# Altium project FLEXI_HAL_Quark.PrjPCB (part 4 of 5)

## Sheet Limit_Switches.SchDoc: RP2040 CNC
size B; Author: AM; CompanyName: Expatria Technologies; DrawnBy: A.Marles; Engineer: AM; Organization: Expatria Technolgoies; DocumentNumber: 7; Revision: A1; SheetNumber: 7; SheetTotal: 14
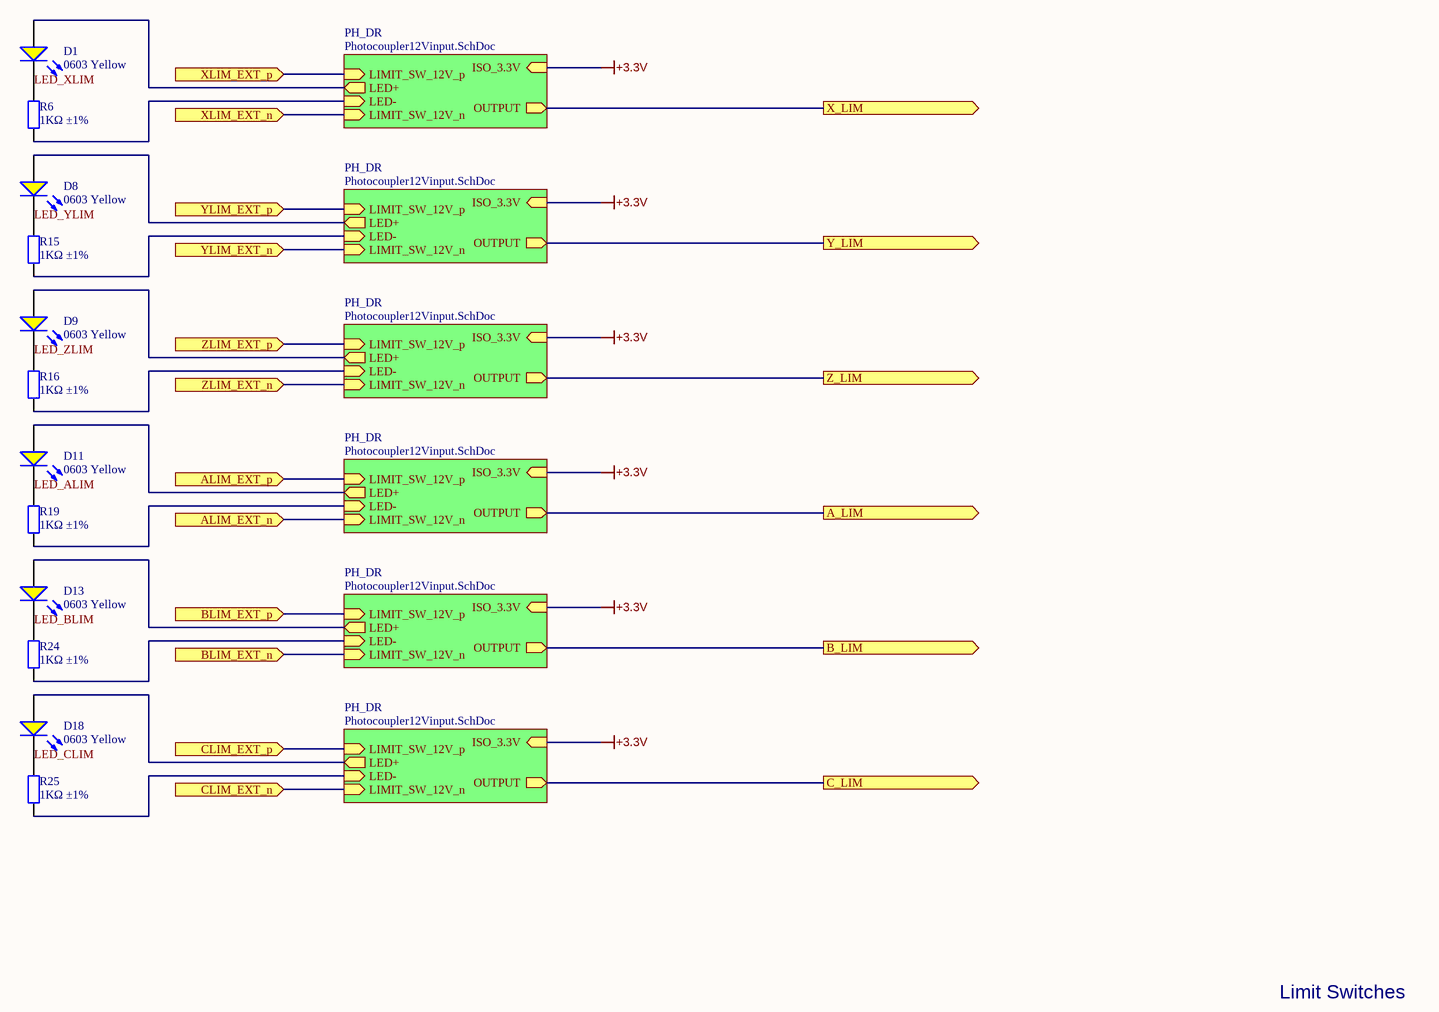
[diagram p18: Limit_Switches.SchDoc]

### Parts
D1  0603 Yellow  [0603_LED_S1]
D8  0603 Yellow  [0603_LED_S1]
D9  0603 Yellow  [0603_LED_S1]
D11  0603 Yellow  [0603_LED_S1]
D13  0603 Yellow  [0603_LED_S1]
D18  0603 Yellow  [0603_LED_S1]
R6  1KΩ ±1%  [0603_R]
R15  1KΩ ±1%  [0603_R]
R16  1KΩ ±1%  [0603_R]
R19  1KΩ ±1%  [0603_R]
R24  1KΩ ±1%  [0603_R]
R25  1KΩ ±1%  [0603_R]

### Sub-sheets
PH_DR = Photocoupler12Vinput.SchDoc: OUTPUT (out), LED+ (out), LED- (in), ISO_3.3V (in), LIMIT_SW_12V_n (in), LIMIT_SW_12V_p (in)
PH_DR = Photocoupler12Vinput.SchDoc: OUTPUT (out), LED+ (out), LED- (in), ISO_3.3V (in), LIMIT_SW_12V_n (in), LIMIT_SW_12V_p (in)
PH_DR = Photocoupler12Vinput.SchDoc: OUTPUT (out), LED+ (out), LED- (in), ISO_3.3V (in), LIMIT_SW_12V_n (in), LIMIT_SW_12V_p (in)
PH_DR = Photocoupler12Vinput.SchDoc: OUTPUT (out), LED+ (out), LED- (in), ISO_3.3V (in), LIMIT_SW_12V_n (in), LIMIT_SW_12V_p (in)
PH_DR = Photocoupler12Vinput.SchDoc: OUTPUT (out), LED+ (out), LED- (in), ISO_3.3V (in), LIMIT_SW_12V_n (in), LIMIT_SW_12V_p (in)
PH_DR = Photocoupler12Vinput.SchDoc: OUTPUT (out), LED+ (out), LED- (in), ISO_3.3V (in), LIMIT_SW_12V_n (in), LIMIT_SW_12V_p (in)

### Ports
A_LIM (out), ALIM_EXT_n (in), ALIM_EXT_p (in), B_LIM (out), BLIM_EXT_n (in), BLIM_EXT_p (in), C_LIM (out), CLIM_EXT_n (in), CLIM_EXT_p (in), X_LIM (out), XLIM_EXT_n (in), XLIM_EXT_p (in), Y_LIM (out), YLIM_EXT_n (in), YLIM_EXT_p (in), Z_LIM (out), ZLIM_EXT_n (in), ZLIM_EXT_p (in)

### Nets
+3.3V: D1.A D8.A D9.A D11.A D13.A D18.A ; sheet PH_DR/LED+, sheet PH_DR/ISO_3.3V, sheet PH_DR/LED+, sheet PH_DR/ISO_3.3V, sheet PH_DR/LED+, sheet PH_DR/ISO_3.3V, sheet PH_DR/LED+, sheet PH_DR/ISO_3.3V, sheet PH_DR/LED+, sheet PH_DR/ISO_3.3V, sheet PH_DR/LED+, sheet PH_DR/ISO_3.3V
A_LIM: R19.2 ; port A_LIM, sheet PH_DR/OUTPUT, sheet PH_DR/LED-
ALIM_EXT_n: port ALIM_EXT_n, sheet PH_DR/LIMIT_SW_12V_n
ALIM_EXT_p: port ALIM_EXT_p, sheet PH_DR/LIMIT_SW_12V_p
B_LIM: R24.2 ; port B_LIM, sheet PH_DR/OUTPUT, sheet PH_DR/LED-
BLIM_EXT_n: port BLIM_EXT_n, sheet PH_DR/LIMIT_SW_12V_n
BLIM_EXT_p: port BLIM_EXT_p, sheet PH_DR/LIMIT_SW_12V_p
C_LIM: R25.2 ; port C_LIM, sheet PH_DR/OUTPUT, sheet PH_DR/LED-
CLIM_EXT_n: port CLIM_EXT_n, sheet PH_DR/LIMIT_SW_12V_n
CLIM_EXT_p: port CLIM_EXT_p, sheet PH_DR/LIMIT_SW_12V_p
LED_ALIM: D11.K R19.1
LED_BLIM: D13.K R24.1
LED_CLIM: D18.K R25.1
LED_XLIM: D1.K R6.1
LED_YLIM: D8.K R15.1
LED_ZLIM: D9.K R16.1
X_LIM: R6.2 ; port X_LIM, sheet PH_DR/OUTPUT, sheet PH_DR/LED-
XLIM_EXT_n: port XLIM_EXT_n, sheet PH_DR/LIMIT_SW_12V_n
XLIM_EXT_p: port XLIM_EXT_p, sheet PH_DR/LIMIT_SW_12V_p
Y_LIM: R15.2 ; port Y_LIM, sheet PH_DR/OUTPUT, sheet PH_DR/LED-
YLIM_EXT_n: port YLIM_EXT_n, sheet PH_DR/LIMIT_SW_12V_n
YLIM_EXT_p: port YLIM_EXT_p, sheet PH_DR/LIMIT_SW_12V_p
Z_LIM: R16.2 ; port Z_LIM, sheet PH_DR/OUTPUT, sheet PH_DR/LED-
ZLIM_EXT_n: port ZLIM_EXT_n, sheet PH_DR/LIMIT_SW_12V_n
ZLIM_EXT_p: port ZLIM_EXT_p, sheet PH_DR/LIMIT_SW_12V_p

### Notes on the sheet
- Limit Switches
- SHEET
- Expatria Technologies
- 1136 Glade Court
- Port Coquitlam, BC V3B 1R5
- PROJECT
- SIZE
- ENGR
- MODIFIED
- DOCUMENT
- REV
- Copyright Expatria Technologies 2022. This document describes Open Hardware and is licensed under the CERN-OHL-S v2. No warranty is implied or expressed.
- EMAIL: INFO@EXPATRIA.CA
- B
- /

### Library data of the parts
D1 D8 D9 D11 D13 D18 = 0603 LED Yellow: LED; ComponentLink1Description: 供应商链接; ComponentLink1URL: http://www.szlcsc.com/product/details_73147.html; Package: 0603; Supplier: LC; SuppliersPartNumber: C72038; Color: Yellow
R6 R15 R16 R19 R24 R25 = 0603 1K (1001) 1%: Chip resistor; Manufacturer: Uniroyal Elec; PartNumber: 0603WAF1001T5E; Power: 1/10W; ComponentLink1Description: Supplier link; ComponentLink1URL: http://www.szlcsc.com/product/details_21904.html; Package: 0603; Supplier: LC; SuppliersPartNumber: C21190; Resistance: 1KΩ; Tolerance: 1%

## Sheet Photocoupler12Vinput.SchDoc: STM32F446 CNC
size B; Author: AM; CompanyName: Expatria Technologies; DrawnBy: A.Marles; Engineer: AM; Organization: Expatria Technolgoies; DocumentNumber: 14; Revision: A1; SheetNumber: 14; SheetTotal: 14
Used 11 times, as channels STM32F446 CNC Controller/Mezzanine Connector/LIM_SW/PH_DR, STM32F446 CNC Controller/Mezzanine Connector/LIM_SW/PH_DR, STM32F446 CNC Controller/Mezzanine Connector/LIM_SW/PH_DR, STM32F446 CNC Controller/Mezzanine Connector/LIM_SW/PH_DR, STM32F446 CNC Controller/Mezzanine Connector/LIM_SW/PH_DR, STM32F446 CNC Controller/Mezzanine Connector/LIM_SW/PH_DR, STM32F446 CNC Controller/Mezzanine Connector/USR_SW/PH_CY, STM32F446 CNC Controller/Mezzanine Connector/USR_SW/PH_FD, STM32F446 CNC Controller/Mezzanine Connector/USR_SW/PH_DR, STM32F446 CNC Controller/Mezzanine Connector/USR_SW/PH_TL, STM32F446 CNC Controller/Mezzanine Connector/USR_SW/PH_PR. Parts and nets are listed once, with the designators drawn on the sheet.
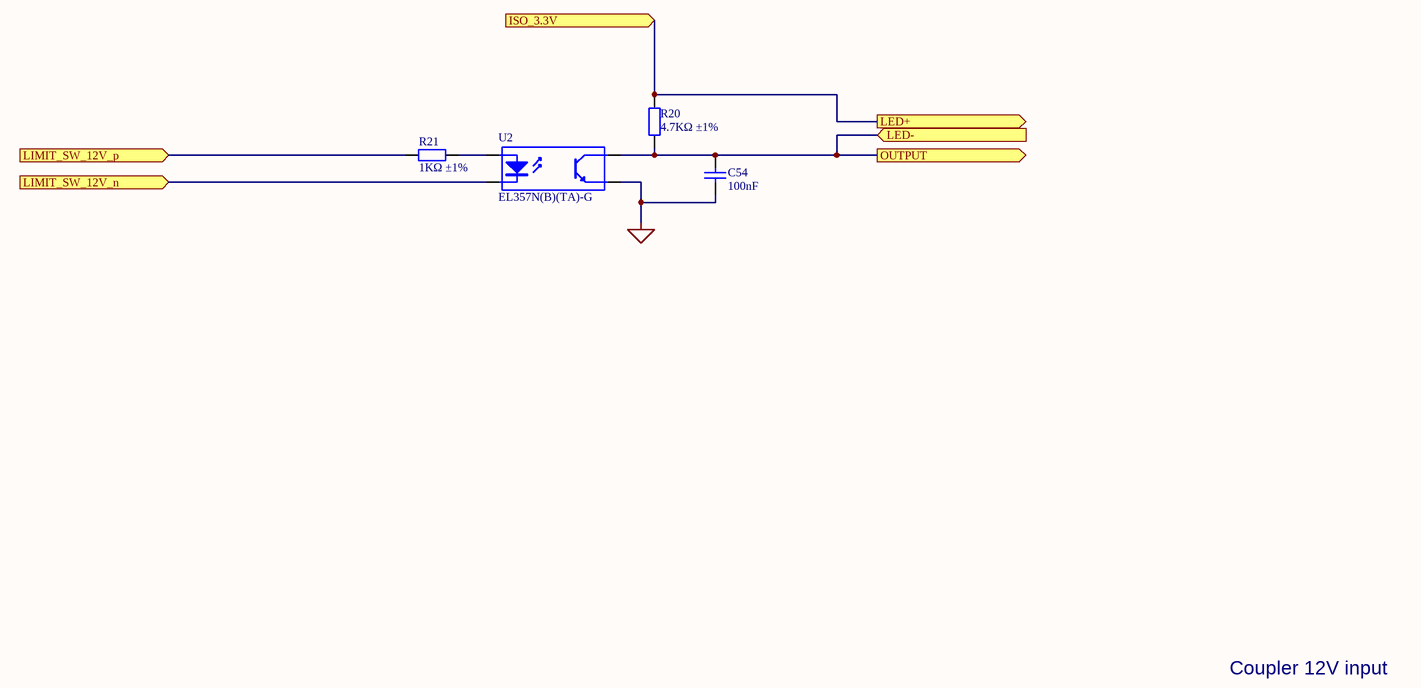
[diagram p19: Photocoupler12Vinput.SchDoc]

### Parts
C54  100nF  [0603_C]
R20  4.7KΩ ±1%  [0603_R]
R21  1KΩ ±1%  [0603_R]
U2  EL357N(B)(TA)-G  [SOP-4_P2.54]

### Ports
ISO_3.3V (in), LED+ (out), LED- (in), LIMIT_SW_12V_n (in), LIMIT_SW_12V_p (in), OUTPUT (out)

### Nets
MCU_GND: C54.1 U2.3(E)
ISO_3.3V: R20.2 ; port LED+, port ISO_3.3V
LED-: C54.2 R20.1 U2.4(C) ; port OUTPUT, port LED-
LIMIT_SW_12V_n: U2.2(K) ; port LIMIT_SW_12V_n
LIMIT_SW_12V_p: R21.1 ; port LIMIT_SW_12V_p
NetR21_2: R21.2 U2.1(A)

### Channels
STM32F446 CNC Controller/Mezzanine Connector/LIM_SW/PH_DR: designators end in _STM32F446_CNC_Controller_Mezzanine_Connector_LIM_SW_PH_DR#1; ports ISO_3.3V=+3.3V LED+=+3.3V LED-=X_LIM LIMIT_SW_12V_n=XLIM_EXT_n LIMIT_SW_12V_p=XLIM_EXT_p OUTPUT=X_LIM
STM32F446 CNC Controller/Mezzanine Connector/LIM_SW/PH_DR: designators end in _STM32F446_CNC_Controller_Mezzanine_Connector_LIM_SW_PH_DR#2; ports ISO_3.3V=+3.3V LED+=+3.3V LED-=Y_LIM LIMIT_SW_12V_n=YLIM_EXT_n LIMIT_SW_12V_p=YLIM_EXT_p OUTPUT=Y_LIM
STM32F446 CNC Controller/Mezzanine Connector/LIM_SW/PH_DR: designators end in _STM32F446_CNC_Controller_Mezzanine_Connector_LIM_SW_PH_DR#3; ports ISO_3.3V=+3.3V LED+=+3.3V LED-=Z_LIM LIMIT_SW_12V_n=ZLIM_EXT_n LIMIT_SW_12V_p=ZLIM_EXT_p OUTPUT=Z_LIM
STM32F446 CNC Controller/Mezzanine Connector/LIM_SW/PH_DR: designators end in _STM32F446_CNC_Controller_Mezzanine_Connector_LIM_SW_PH_DR#4; ports ISO_3.3V=+3.3V LED+=+3.3V LED-=A_LIM LIMIT_SW_12V_n=ALIM_EXT_n LIMIT_SW_12V_p=ALIM_EXT_p OUTPUT=A_LIM
STM32F446 CNC Controller/Mezzanine Connector/LIM_SW/PH_DR: designators end in _STM32F446_CNC_Controller_Mezzanine_Connector_LIM_SW_PH_DR#5; ports ISO_3.3V=+3.3V LED+=+3.3V LED-=B_LIM LIMIT_SW_12V_n=BLIM_EXT_n LIMIT_SW_12V_p=BLIM_EXT_p OUTPUT=B_LIM
STM32F446 CNC Controller/Mezzanine Connector/LIM_SW/PH_DR: designators end in _STM32F446_CNC_Controller_Mezzanine_Connector_LIM_SW_PH_DR#6; ports ISO_3.3V=+3.3V LED+=+3.3V LED-=C_LIM LIMIT_SW_12V_n=CLIM_EXT_n LIMIT_SW_12V_p=CLIM_EXT_p OUTPUT=C_LIM
STM32F446 CNC Controller/Mezzanine Connector/USR_SW/PH_CY: designators end in _PH_CY; ports ISO_3.3V=+3.3V LED+=+3.3V LED-=CYC/ST LIMIT_SW_12V_n=RUN_EXT_n LIMIT_SW_12V_p=RUN_EXT_p OUTPUT=CYC/ST
STM32F446 CNC Controller/Mezzanine Connector/USR_SW/PH_FD: designators end in _PH_FD; ports ISO_3.3V=+3.3V LED+=+3.3V LED-=FD/HLD LIMIT_SW_12V_n=HOLD_EXT_n LIMIT_SW_12V_p=HOLD_EXT_p OUTPUT=FD/HLD
STM32F446 CNC Controller/Mezzanine Connector/USR_SW/PH_DR: designators end in _STM32F446_CNC_Controller_Mezzanine_Connector_USR_SW_PH_DR; ports ISO_3.3V=+3.3V LED+=+3.3V LED-=DOOR LIMIT_SW_12V_n=DOOR_EXT_n LIMIT_SW_12V_p=DOOR_EXT_p OUTPUT=DOOR
STM32F446 CNC Controller/Mezzanine Connector/USR_SW/PH_TL: designators end in _PH_TL; ports ISO_3.3V=+3.3V LED+=+3.3V LED-=TOOL LIMIT_SW_12V_n=TOOL_EXT_n LIMIT_SW_12V_p=TOOL_EXT_p OUTPUT=TOOL
STM32F446 CNC Controller/Mezzanine Connector/USR_SW/PH_PR: designators end in _PH_PR; ports ISO_3.3V=+3.3V LED+=+3.3V LED-=PROBE LIMIT_SW_12V_n=PROBE_EXT_n LIMIT_SW_12V_p=PROBE_EXT_p OUTPUT=PROBE

### Notes on the sheet
- Coupler 12V input
- SHEET
- Expatria Technologies
- 1136 Glade Court
- Port Coquitlam, BC V3B 1R5
- PROJECT
- SIZE
- ENGR
- MODIFIED
- DOCUMENT
- REV
- Copyright Expatria Technologies 2022. This document describes Open Hardware and is licensed under the CERN-OHL-S v2. No warranty is implied or expressed.
- EMAIL: INFO@EXPATRIA.CA
- B
- /

### Library data of the parts
C54 = 0603 100nF (104) 10% 50V: Chip capacitors; Manufacturer: YAGEO; PartNumber: CC0603KRX7R9BB104; Tolerance: 10%; Voltage: 50V; ComponentLink1Description: Supplier link; ComponentLink1URL: http://www.szlcsc.com/product/details_15331.html; Package: 0603; Supplier: LC; SuppliersPartNumber: C14663; Capacitance: 100nF
R20 = 0603 4.7K (4701) 1%: Chip resistor; Manufacturer: Uniroyal Elec; PartNumber: 0603WAF4701T5E; Power: 1/10W; ComponentLink1Description: Supplier link; ComponentLink1URL: http://www.szlcsc.com/product/details_23889.html; Package: 0603; Supplier: LC; SuppliersPartNumber: C23162; Resistance: 4.7KΩ; Tolerance: 1%
R21 = 0603 1K (1001) 1%: as R6 on sheet Limit_Switches; ComponentLink1Description: Supplier link; ComponentLink1URL: http://www.szlcsc.com/product/details_21904.html; Package: 0603; Supplier: LC; SuppliersPartNumber: C21190; Resistance: 1KΩ; Tolerance: 1%
U2 = EL357N(B)(TA)-G_[C6649]: OPTOISOLATOR 3.75KV TRANS 4-SOP; Manufacturer 1: Everlight Elec; ComponentLink1Description: 供应商链接; ComponentLink1URL: http://www.szlcsc.com/product/details_7114.html; Package: SOP-4_P2.54; Supplier: LC; SuppliersPartNumber: C6649; Manufacturer Part Number 1: EL357N(B)(TA)-G

## Sheet Misc_switches.SchDoc: RP2040 CNC
size B; Author: AM; CompanyName: Expatria Technologies; DrawnBy: A.Marles; Engineer: AM; Organization: Expatria Technolgoies; DocumentNumber: 8; Revision: A1; SheetNumber: 8; SheetTotal: 14
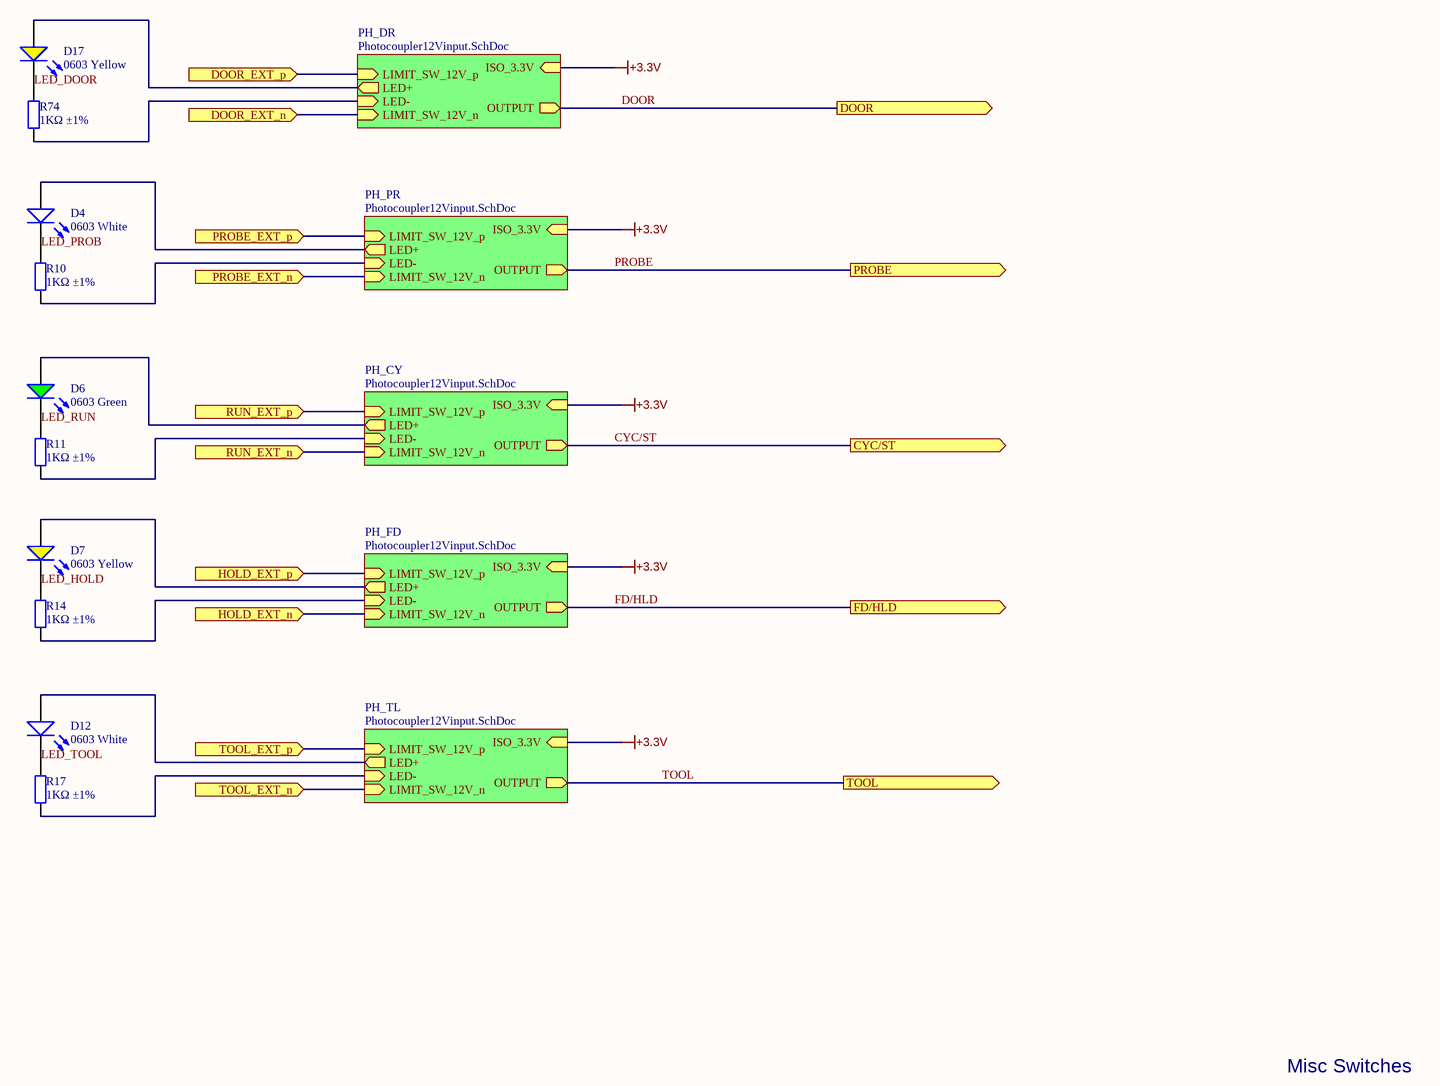
[diagram p20: Misc_switches.SchDoc]

### Parts
D4  0603 White  [0603_LED_S1]
D6  0603 Green  [0603_LED_S1]
D7  0603 Yellow  [0603_LED_S1]
D12  0603 White  [0603_LED_S1]
D17  0603 Yellow  [0603_LED_S1]
R10  1KΩ ±1%  [0603_R]
R11  1KΩ ±1%  [0603_R]
R14  1KΩ ±1%  [0603_R]
R17  1KΩ ±1%  [0603_R]
R74  1KΩ ±1%  [0603_R]

### Sub-sheets
PH_CY = Photocoupler12Vinput.SchDoc: OUTPUT (out), LED- (in), LED+ (out), ISO_3.3V (in), LIMIT_SW_12V_n (in), LIMIT_SW_12V_p (in)
PH_DR = Photocoupler12Vinput.SchDoc: OUTPUT (out), LED+ (out), LED- (in), ISO_3.3V (in), LIMIT_SW_12V_n (in), LIMIT_SW_12V_p (in)
PH_FD = Photocoupler12Vinput.SchDoc: OUTPUT (out), LED+ (out), LED- (in), ISO_3.3V (in), LIMIT_SW_12V_n (in), LIMIT_SW_12V_p (in)
PH_PR = Photocoupler12Vinput.SchDoc: OUTPUT (out), LED+ (out), LED- (in), ISO_3.3V (in), LIMIT_SW_12V_n (in), LIMIT_SW_12V_p (in)
PH_TL = Photocoupler12Vinput.SchDoc: OUTPUT (out), LED+ (out), LED- (in), ISO_3.3V (in), LIMIT_SW_12V_n (in), LIMIT_SW_12V_p (in)

### Ports
CYC/ST (out), DOOR (out), DOOR_EXT_n (in), DOOR_EXT_p (in), FD/HLD (out), HOLD_EXT_n (in), HOLD_EXT_p (in), PROBE (out), PROBE_EXT_n (in), PROBE_EXT_p (in), RUN_EXT_n (in), RUN_EXT_p (in), TOOL (out), TOOL_EXT_n (in), TOOL_EXT_p (in)

### Nets
+3.3V: D4.A D6.A D7.A D12.A D17.A ; sheet PH_CY/LED+, sheet PH_CY/ISO_3.3V, sheet PH_FD/LED+, sheet PH_FD/ISO_3.3V, sheet PH_DR/LED+, sheet PH_DR/ISO_3.3V, sheet PH_TL/LED+, sheet PH_TL/ISO_3.3V, sheet PH_PR/LED+, sheet PH_PR/ISO_3.3V
CYC/ST: R11.2 ; port CYC/ST, sheet PH_CY/OUTPUT, sheet PH_CY/LED-
DOOR: R74.2 ; port DOOR, sheet PH_DR/OUTPUT, sheet PH_DR/LED-
DOOR_EXT_n: port DOOR_EXT_n, sheet PH_DR/LIMIT_SW_12V_n
DOOR_EXT_p: port DOOR_EXT_p, sheet PH_DR/LIMIT_SW_12V_p
FD/HLD: R14.2 ; port FD/HLD, sheet PH_FD/OUTPUT, sheet PH_FD/LED-
HOLD_EXT_n: port HOLD_EXT_n, sheet PH_FD/LIMIT_SW_12V_n
HOLD_EXT_p: port HOLD_EXT_p, sheet PH_FD/LIMIT_SW_12V_p
LED_DOOR: D17.K R74.1
LED_HOLD: D7.K R14.1
LED_PROB: D4.K R10.1
LED_RUN: D6.K R11.1
LED_TOOL: D12.K R17.1
PROBE: R10.2 ; port PROBE, sheet PH_PR/OUTPUT, sheet PH_PR/LED-
PROBE_EXT_n: port PROBE_EXT_n, sheet PH_PR/LIMIT_SW_12V_n
PROBE_EXT_p: port PROBE_EXT_p, sheet PH_PR/LIMIT_SW_12V_p
RUN_EXT_n: port RUN_EXT_n, sheet PH_CY/LIMIT_SW_12V_n
RUN_EXT_p: port RUN_EXT_p, sheet PH_CY/LIMIT_SW_12V_p
TOOL: R17.2 ; port TOOL, sheet PH_TL/OUTPUT, sheet PH_TL/LED-
TOOL_EXT_n: port TOOL_EXT_n, sheet PH_TL/LIMIT_SW_12V_n
TOOL_EXT_p: port TOOL_EXT_p, sheet PH_TL/LIMIT_SW_12V_p

### Notes on the sheet
- Misc Switches
- SHEET
- Expatria Technologies
- 1136 Glade Court
- Port Coquitlam, BC V3B 1R5
- PROJECT
- SIZE
- ENGR
- MODIFIED
- DOCUMENT
- REV
- Copyright Expatria Technologies 2022. This document describes Open Hardware and is licensed under the CERN-OHL-S v2. No warranty is implied or expressed.
- EMAIL: INFO@EXPATRIA.CA
- B
- /

### Library data of the parts
D4 D12 = 0603 LED White: LED; ComponentLink1Description: 供应商链接; ComponentLink1URL: http://www.szlcsc.com/product/details_2663.html; Package: 0603; Supplier: LC; SuppliersPartNumber: C2290; Color: White
D6 = 0603 LED Green: LED; ComponentLink1Description: 供应商链接; ComponentLink1URL: http://www.szlcsc.com/product/details_73152.html; Package: 0603; Supplier: LC; SuppliersPartNumber: C72043; Color: Green
D7 D17 = 0603 LED Yellow: LED; ComponentLink1Description: 供应商链接; ComponentLink1URL: http://www.szlcsc.com/product/details_73147.html; Package: 0603; Supplier: LC; SuppliersPartNumber: C72038; Color: Yellow
R10 R11 R14 R17 R74 = 0603 1K (1001) 1%: as R6 on sheet Limit_Switches; ComponentLink1Description: Supplier link; ComponentLink1URL: http://www.szlcsc.com/product/details_21904.html; Package: 0603; Supplier: LC; SuppliersPartNumber: C21190; Resistance: 1KΩ; Tolerance: 1%

## Sheet Aux_Inputs.SchDoc: RP2040 CNC
size B; Author: AM; CompanyName: Expatria Technologies; DrawnBy: A.Marles; Engineer: AM; Organization: Expatria Technolgoies; DocumentNumber: 7; Revision: A1; SheetNumber: 7; SheetTotal: 14
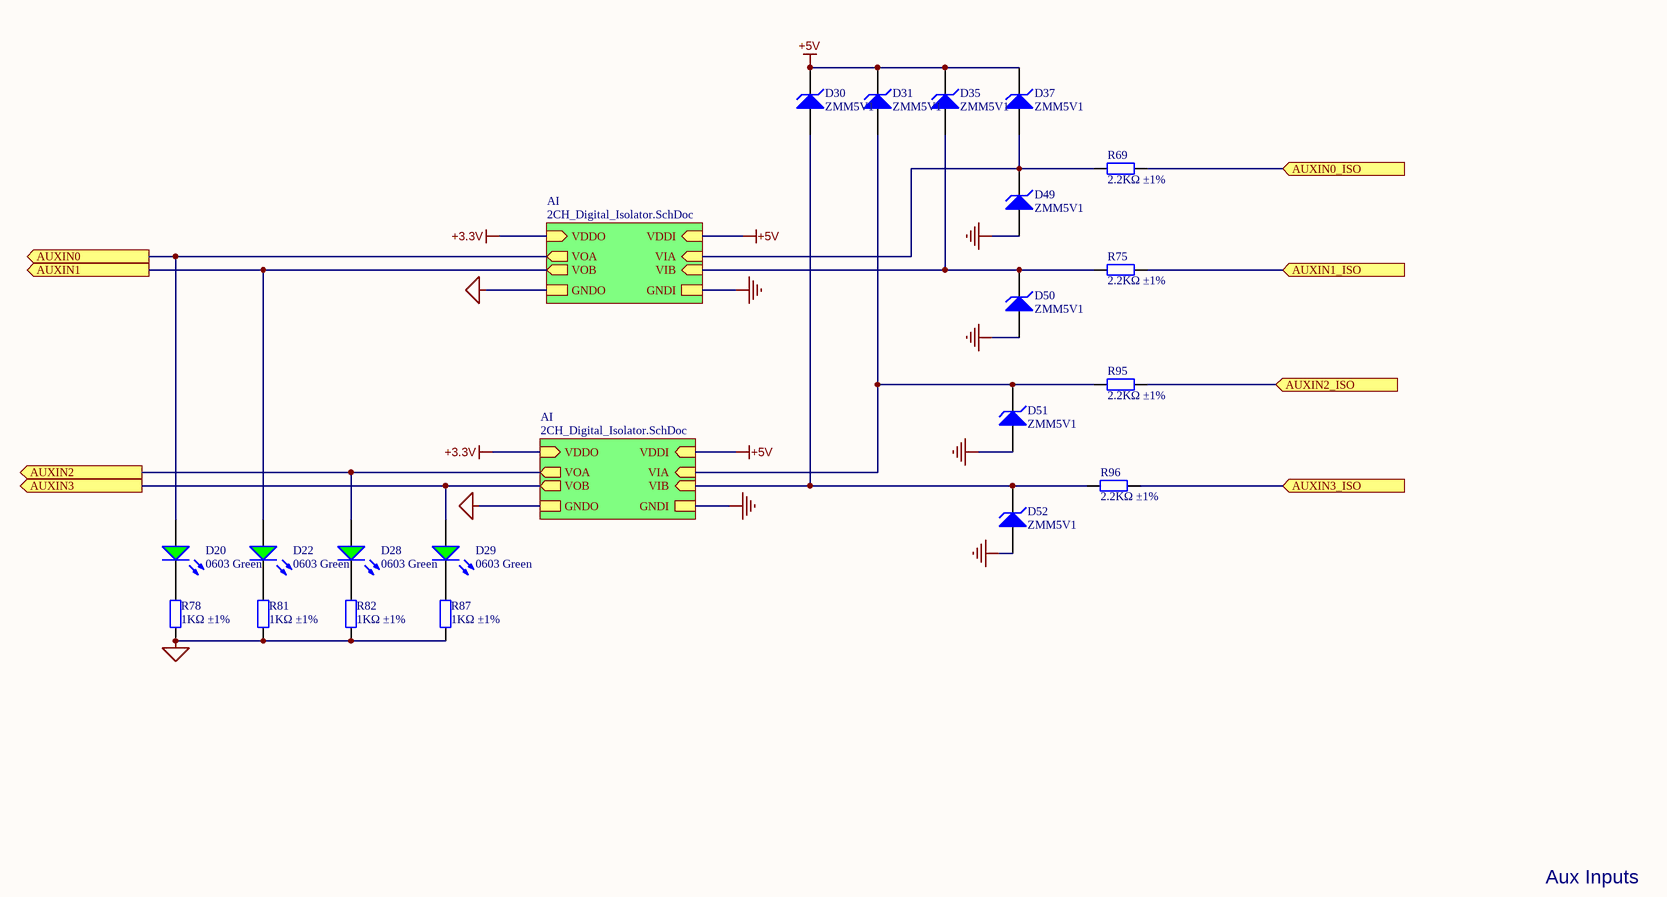
[diagram p21: Aux_Inputs.SchDoc]

### Parts
D20  0603 Green  [0603_LED_S1]
D22  0603 Green  [0603_LED_S1]
D28  0603 Green  [0603_LED_S1]
D29  0603 Green  [0603_LED_S1]
D30  ZMM5V1  [LL-34]
D31  ZMM5V1  [LL-34]
D35  ZMM5V1  [LL-34]
D37  ZMM5V1  [LL-34]
D49  ZMM5V1  [LL-34]
D50  ZMM5V1  [LL-34]
D51  ZMM5V1  [LL-34]
D52  ZMM5V1  [LL-34]
R69  2.2KΩ ±1%  [0603_R]
R75  2.2KΩ ±1%  [0603_R]
R78  1KΩ ±1%  [0603_R]
R81  1KΩ ±1%  [0603_R]
R82  1KΩ ±1%  [0603_R]
R87  1KΩ ±1%  [0603_R]
R95  2.2KΩ ±1%  [0603_R]
R96  2.2KΩ ±1%  [0603_R]

### Sub-sheets
AI = 2CH_Digital_Isolator.SchDoc: VDDO (in), VIB (in), VIA (in), VOB (out), VOA (out), VDDI (in), GNDO, GNDI
AI = 2CH_Digital_Isolator.SchDoc: VDDO (in), VIB (in), VIA (in), VOB (out), VOA (out), VDDI (in), GNDO, GNDI

### Ports
AUXIN0 (out), AUXIN0_ISO (in), AUXIN1 (out), AUXIN1_ISO (in), AUXIN2 (out), AUXIN2_ISO (in), AUXIN3 (out), AUXIN3_ISO (in)

### Nets
+3.3V: sheet AI/VDDO, sheet AI/VDDO
+5V: D30.2(K) D31.2(K) D35.2(K) D37.2(K) ; sheet AI/VDDI, sheet AI/VDDI
GND: D49.1(A) D50.1(A) D51.1(A) D52.1(A) ; sheet AI/GNDI, sheet AI/GNDI
MCU_GND: R78.2 R81.2 R82.2 R87.2 ; sheet AI/GNDO, sheet AI/GNDO
AUXIN0_ISO: R69.1 ; port AUXIN0_ISO
AUXIN1_ISO: R75.1 ; port AUXIN1_ISO
AUXIN2_ISO: R95.1 ; port AUXIN2_ISO
AUXIN3_ISO: R96.1 ; port AUXIN3_ISO
AUXIN_0: D20.A ; port AUXIN0, sheet AI/VOA
AUXIN_1: D22.A ; port AUXIN1, sheet AI/VOB
AUXIN_2: D28.A ; port AUXIN2, sheet AI/VOA
AUXIN_3: D29.A ; port AUXIN3, sheet AI/VOB
VIA: D37.1(A) D49.2(K) R69.2 ; sheet AI/VIA
VIA: D31.1(A) D51.2(K) R95.2 ; sheet AI/VIA  [a separate net that carries the same name]
VIB: D35.1(A) D50.2(K) R75.2 ; sheet AI/VIB
VIB: D30.1(A) D52.2(K) R96.2 ; sheet AI/VIB  [a separate net that carries the same name]
NetD20_K: D20.K R78.1
NetD22_K: D22.K R81.1
NetD28_K: D28.K R82.1
NetD29_K: D29.K R87.1

### Notes on the sheet
- Aux Inputs
- SHEET
- Expatria Technologies
- 1136 Glade Court
- Port Coquitlam, BC V3B 1R5
- PROJECT
- SIZE
- ENGR
- MODIFIED
- DOCUMENT
- REV
- Copyright Expatria Technologies 2022. This document describes Open Hardware and is licensed under the CERN-OHL-S v2. No warranty is implied or expressed.
- EMAIL: INFO@EXPATRIA.CA
- B
- /

### Library data of the parts
D20 D22 D28 D29 = 0603 LED Green: LED; ComponentLink1Description: 供应商链接; ComponentLink1URL: http://www.szlcsc.com/product/details_73152.html; Package: 0603; Supplier: LC; SuppliersPartNumber: C72043; Color: Green
D30 D31 D35 D37 D49-D52 = LL-34 ZMM5V6: 500mW - 0.1uA @ 1V 5.1V LL-34 Zener Diodes ROHS; ComponentLink1Description: 供应商链接; ComponentLink1URL: http://www.szlcsc.com/product/details_8541.html; Package: LL-34; Supplier: LC; SuppliersPartNumber: C2982194
R69 R75 R95 R96 = 0603 2.2K (2201) 1%: Chip resistor; Manufacturer: Uniroyal Elec; PartNumber: 0603WAF2201T5E; Power: 1/10W; ComponentLink1Description: Supplier link; ComponentLink1URL: http://www.szlcsc.com/product/details_4597.html; Package: 0603; Supplier: LC; SuppliersPartNumber: C4190; Resistance: 2.2KΩ; Tolerance: 1%
R78 R81 R82 R87 = 0603 1K (1001) 1%: as R6 on sheet Limit_Switches; ComponentLink1Description: Supplier link; ComponentLink1URL: http://www.szlcsc.com/product/details_21904.html; Package: 0603; Supplier: LC; SuppliersPartNumber: C21190; Resistance: 1KΩ; Tolerance: 1%

## Sheet 2xparallelswitch_HALT.SchDoc: RP2040 CNC
size B; Author: AM; CompanyName: Expatria Technologies; DrawnBy: A.Marles; Engineer: AM; Organization: Expatria Technolgoies; DocumentNumber: 13; Revision: A1; SheetNumber: 13; SheetTotal: 14
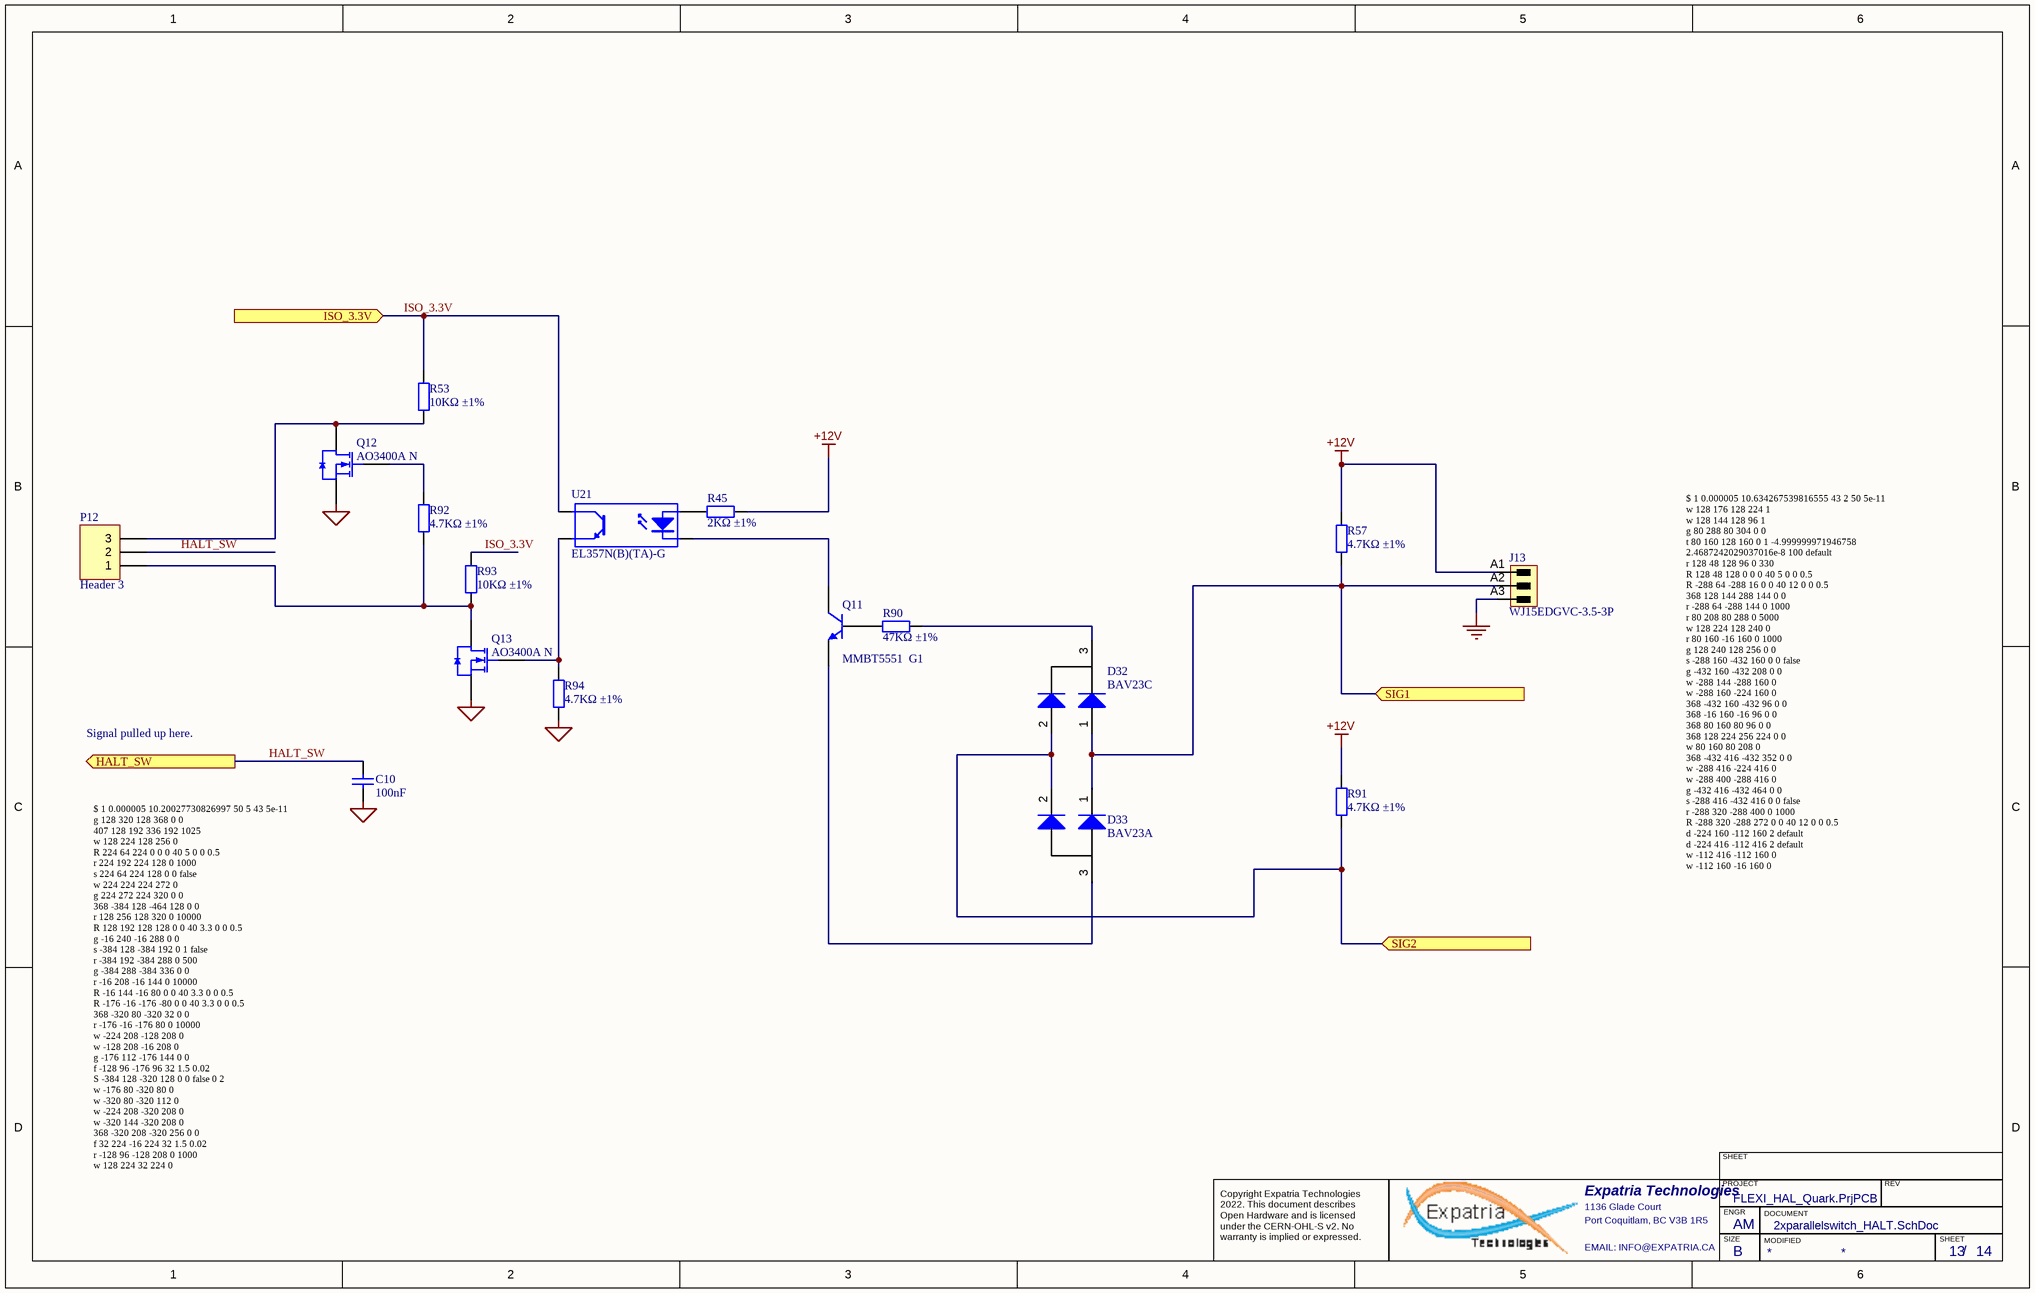
[diagram p22: 2xparallelswitch_HALT.SchDoc]

### Parts
C10  100nF  [0603_C]
D32  BAV23C  [SOT-23(SOT-23-3)]
D33  BAV23A  [SOT-23(SOT-23-3)]
J13  WJ15EDGVC-3.5-3P  [691321100003 - 3.5mm  3p]
P12  Header 3  [HDR1X3]
Q11  MMBT5551  G1  [SOT-23(SOT-23-3)]
Q12  AO3400A N  [SOT-23-3L]
Q13  AO3400A N  [SOT-23-3L]
R45  2KΩ ±1%  [0603_R]
R53  10KΩ ±1%  [0603_R]
R57  4.7KΩ ±1%  [0603_R]
R90  47KΩ ±1%  [0603_R]
R91  4.7KΩ ±1%  [0603_R]
R92  4.7KΩ ±1%  [0603_R]
R93  10KΩ ±1%  [0603_R]
R94  4.7KΩ ±1%  [0603_R]
U21  EL357N(B)(TA)-G  [SOP-4_P2.54]

### Ports
HALT_SW (out), ISO_3.3V (in), SIG1 (in), SIG2 (in)

### Nets
+12V: J13.A1 R45.2 R57.2 R91.2
GND: J13.A3
ISO_3.3V: R53.2 R93.2 U21.4(C) ; port ISO_3.3V  [project net +3.3V]
MCU_GND: C10.1 Q12.2(S) Q13.2(S) R94.1
HALT_out: D32.2(A) D33.2(K) R91.1 ; port SIG2
HALT_SW: C10.2 P12.2 ; port HALT_SW  [project net HALT_n]
SIG1: D32.1(A) D33.1(K) J13.A2 R57.1 ; port SIG1
NetD32_3: D32.3(K) R90.1
NetD33_3: D33.3(A) Q11.2(E)
NetP12_1: P12.1 Q13.3(D) R92.1 R93.1
NetP12_3: P12.3 Q12.3(D) R53.1
NetQ11_1: Q11.1(B) R90.2
NetQ11_3: Q11.3(C) U21.2(K)
NetQ12_1: Q12.1(G) R92.2
NetQ13_1: Q13.1(G) R94.2 U21.3(E)
NetR45_1: R45.1 U21.1(A)

### Notes on the sheet
- Signal pulled up here.
- $ 1 0.000005 10.634267539816555 43 2 50 5e-11
  w 128 176 128 224 1
  w 128 144 128 96 1
  g 80 288 80 304 0 0
  t 80 160 128 160 0 1 -4.999999971946758 2.4687242029037016e-8 100 default
  r 128 48 128 96 0 330
  R 128 48 128 0 0 0 40 5 0 0 0.5
  R -288 64 -288 16 0 0 40 12 0 0 0.5
  368 128 144 288 144 0 0
  r -288 64 -288 144 0 1000
  r 80 208 80 288 0 5000
  w 128 224 128 240 0
  r 80 160 -16 160 0 1000
  g 128 240 128 256 0 0
  s -288 160 -432 160 0 0 false
  g -432 160 -432 208 0 0
  w -288 144 -288 160 0
  w -288 160 -224 160 0
  368 -432 160 -432 96 0 0
  368 -16 160 -16 96 0 0
  368 80 160 80 96 0 0
  368 128 224 256 224 0 0
  w 80 160 80 208 0
  368 -432 416 -432 352 0 0
  w -288 416 -224 416 0
  w -288 400 -288 416 0
  g -432 416 -432 464 0 0
  s -288 416 -432 416 0 0 false
  r -288 320 -288 400 0 1000
  R -288 320 -288 272 0 0 40 12 0 0 0.5
  d -224 160 -112 160 2 default
  d -224 416 -112 416 2 default
  w -112 416 -112 160 0
  w -112 160 -16 160 0
- (near C10) $ 1 0.000005 10.20027730826997 50 5 43 5e-11
  g 128 320 128 368 0 0
  407 128 192 336 192 1025
  w 128 224 128 256 0
  R 224 64 224 0 0 0 40 5 0 0 0.5
  r 224 192 224 128 0 1000
  s 224 64 224 128 0 0 false
  w 224 224 224 272 0
  g 224 272 224 320 0 0
  368 -384 128 -464 128 0 0
  r 128 256 128 320 0 10000
  R 128 192 128 128 0 0 40 3.3 0 0 0.5
  g -16 240 -16 288 0 0
  s -384 128 -384 192 0 1 false
  r -384 192 -384 288 0 500
  g -384 288 -384 336 0 0
  r -16 208 -16 144 0 10000
  R -16 144 -16 80 0 0 40 3.3 0 0 0.5
  R -176 -16 -176 -80 0 0 40 3.3 0 0 0.5
  368 -320 80 -320 32 0 0
  r -176 -16 -176 80 0 10000
  w -224 208 -128 208 0
  w -128 208 -16 208 0
  g -176 112 -176 144 0 0
  f -128 96 -176 96 32 1.5 0.02
  S -384 128 -320 128 0 0 false 0 2
  w -176 80 -320 80 0
  w -320 80 -320 112 0
  w -224 208 -320 208 0
  w -320 144 -320 208 0
  368 -320 208 -320 256 0 0
  f 32 224 -16 224 32 1.5 0.02
  r -128 96 -128 208 0 1000
  w 128 224 32 224 0
- SHEET
- Expatria Technologies
- 1136 Glade Court
- Port Coquitlam, BC V3B 1R5
- PROJECT
- SIZE
- ENGR
- MODIFIED
- DOCUMENT
- REV
- Copyright Expatria Technologies 2022. This document describes Open Hardware and is licensed under the CERN-OHL-S v2. No warranty is implied or expressed.
- EMAIL: INFO@EXPATRIA.CA
- B
- /

### Library data of the parts
C10 = 0603 100nF (104) 10% 50V: as C54 on sheet Photocoupler12Vinput; ComponentLink1Description: Supplier link; ComponentLink1URL: http://www.szlcsc.com/product/details_15331.html; Package: 0603; Supplier: LC; SuppliersPartNumber: C14663; Capacitance: 100nF
D32 = SOT-23 BAV23C: 250V +150℃@(Tj) 350mW Dual Common Cathode 1.25V@200mA 50ns 100nA@250V 225mA SOT-23 Switching Diode ROHS; ComponentLink1Description: 供应商链接; ComponentLink1URL: http://www.szlcsc.com/product/details_70091.html; Package: SOT-23; Supplier: LC; SuppliersPartNumber: C545540
D33 = SOT-23 BAV23A: 200V -65℃~+150℃@(Tj) 350mW 1 Pair Common Anode 1.25V@200mA 50ns 100nA@200V 400mA SOT-23 Switching Diode ROHS; ComponentLink1Description: 供应商链接; ComponentLink1URL: http://www.szlcsc.com/product/details_70091.html; Package: SOT-23; Supplier: LC; SuppliersPartNumber: C328584
J13 = 3.5mm Terminal Header 3p: Header,Male Pin,Covered(4 Sided) 3 1 0.138"（3.50mm） 3 P=3.5mm Pluggable System Terminal Block RoHS; Manufacturer: Weidmueller; Manufacturer 1: Weidmuller; Manufacturer Part Number 1: 1604480000; Pitch_mm: 3.5 mm; UL_94_flammability_rating: V-0; Side_termination_characteristic: closed side; Solder_pin_length_mm: 3.2 mm; Short_text_for_material: SL 3.50/03/180G 3.2SN OR BX; Pitch_inch: 0.138 inch; PartNumber: WJ15EDGVC-3.5-3P; PackageReference: SL_3_50_180G_03; ComponentLink1URL: http://www.weidmueller.com/; ComponentLink1Description: Manufacturer URL; Packaging: Box; Revision: V1; SuppliersPartNumber: C192778
P12 = Header 3: Header, 3-Pin; Publisher: Altium Limited; SuppliersPartNumber: C49257
Q11 = SOT-23 MMBT5551  G1: 三极管; ComponentLink1Description: 供应商链接; ComponentLink1URL: http://www.szlcsc.com/product/details_2502.html; Package: SOT-23; Supplier: LC; SuppliersPartNumber: C2145
Q12 Q13 = AO3400A N道沟 X0YV1T SOT-23: MOS(场效应管); ComponentLink1Description: 供应商链接; ComponentLink1URL: http://www.szlcsc.com/product/details_21629.html; Package: SOT-23; Supplier: LC; SuppliersPartNumber: C20917
R45 = 0603 2K (2001) 1%: Chip resistor; Manufacturer: Uniroyal Elec; PartNumber: 0603WAF2001T5E; Power: 1/10W; ComponentLink1Description: Supplier link; ComponentLink1URL: http://www.szlcsc.com/product/details_23702.html; Package: 0603; Supplier: LC; SuppliersPartNumber: C22975; Resistance: 2KΩ; Tolerance: 1%
R53 R93 = 0603 10K (1002) 1%: Chip resistor; Manufacturer: Uniroyal Elec; PartNumber: 0603WAF1002T5E; Power: 1/10W; ComponentLink1Description: Supplier link; ComponentLink1URL: http://www.szlcsc.com/product/details_26547.html; Package: 0603; Supplier: LC; SuppliersPartNumber: C25804; Resistance: 10KΩ; Tolerance: 1%
R57 R91 R92 R94 = 0603 4.7K (4701) 1%: as R20 on sheet Photocoupler12Vinput; ComponentLink1Description: Supplier link; ComponentLink1URL: http://www.szlcsc.com/product/details_23889.html; Package: 0603; Supplier: LC; SuppliersPartNumber: C23162; Resistance: 4.7KΩ; Tolerance: 1%
R90 = 0603 47K (4702) 1%: Chip resistor; Manufacturer: Uniroyal Elec; PartNumber: 0603WAF4702T5E; Power: 1/10W; ComponentLink1Description: Supplier link; ComponentLink1URL: http://www.szlcsc.com/product/details_26562.html; Package: 0603; Supplier: LC; SuppliersPartNumber: C25819; Resistance: 47KΩ; Tolerance: 1%
U21 = EL357N(B)(TA)-G_[C6649]: 贴片光耦; ComponentLink1Description: 供应商链接; ComponentLink1URL: http://www.szlcsc.com/product/details_7114.html; Package: SOP-4_P2.54; Supplier: LC; SuppliersPartNumber: C6649